# EAGLE design vcf_leiter (EAGLE 9.5.2)
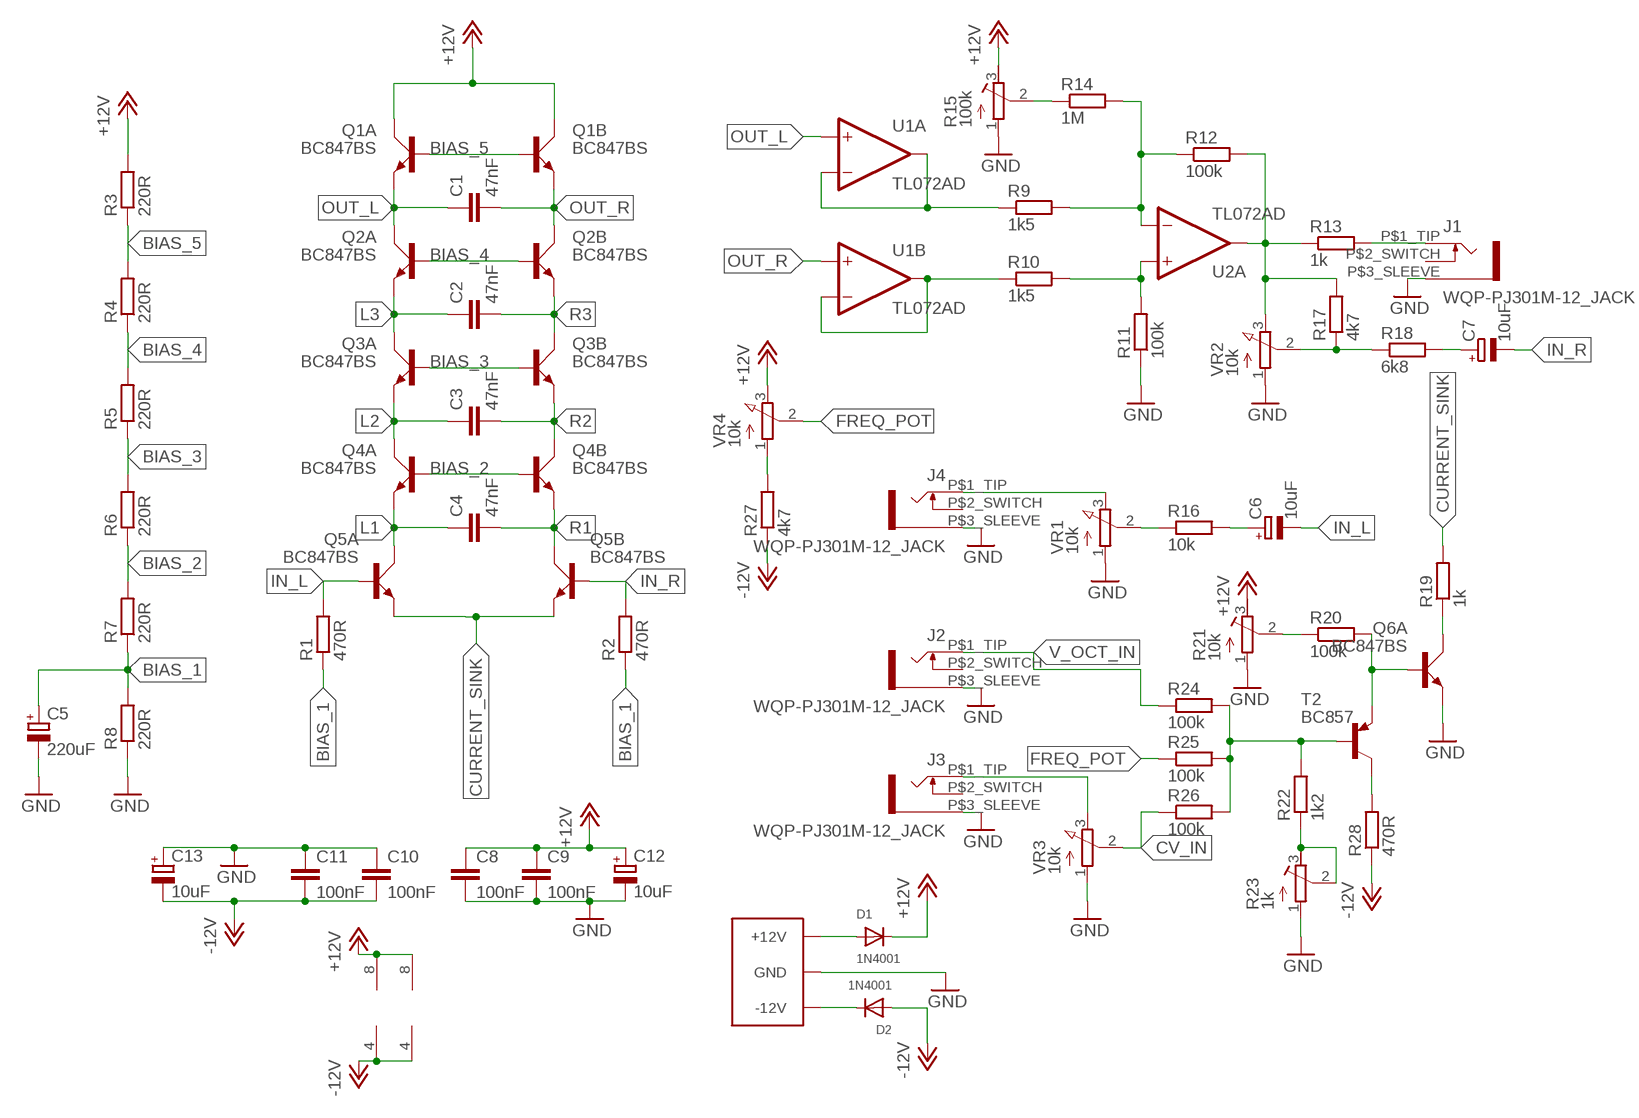
[diagram p0: schematic, sheet 1]

## Parts
C1  47nF  C-EUC0402  [C0402]
C2  47nF  C-EUC0402  [C0402]
C3  47nF  C-EUC0402  [C0402]
C4  47nF  C-EUC0402  [C0402]
C5  220uF  CPOL-EUC  [PANASONIC_C]
C6  10uF  CPOL-EUC  [PANASONIC_C]
C7  10uF  CPOL-EUC  [PANASONIC_C]
C8  100nF  C-EUC0402  [C0402]
C9  100nF  C-EUC0402  [C0402]
C10  100nF  C-EUC0402  [C0402]
C11  100nF  C-EUC0402  [C0402]
C12  10uF  CPOL-EUC  [PANASONIC_C]
C13  10uF  CPOL-EUC  [PANASONIC_C]
C14  EURO_POWER_LOCKFAT-LOCK  [EURO_PWR_HEADER_LOCK]
D1  1N4001  DIODESMA  [SMADIODE]
D2  1N4001  DIODESMA  [SMADIODE]
J1  WQP-PJ301M-12_JACK  [WQP-PJ301M-12_JACK]
J2  WQP-PJ301M-12_JACK  [WQP-PJ301M-12_JACK]
J3  WQP-PJ301M-12_JACK  [WQP-PJ301M-12_JACK]
J4  WQP-PJ301M-12_JACK  [WQP-PJ301M-12_JACK]
Q1  BC847BS  [SOT363_PHILIPS]
Q2  BC847BS  [SOT363_PHILIPS]
Q3  BC847BS  [SOT363_PHILIPS]
Q4  BC847BS  [SOT363_PHILIPS]
Q5  BC847BS  [SOT363_PHILIPS]
Q6  BC847BS  [SOT363_PHILIPS]
R1  470R  R-EU_R0402  [R0402]
R2  470R  R-EU_R0402  [R0402]
R3  220R  R-EU_R0402  [R0402]
R4  220R  R-EU_R0402  [R0402]
R5  220R  R-EU_R0402  [R0402]
R6  220R  R-EU_R0402  [R0402]
R7  220R  R-EU_R0402  [R0402]
R8  220R  R-EU_R0402  [R0402]
R9  1k5  R-EU_R0402  [R0402]
R10  1k5  R-EU_R0402  [R0402]
R11  100k  R-EU_R0402  [R0402]
R12  100k  R-EU_R0402  [R0402]
R13  1k  R-EU_R0402  [R0402]
R14  1M  R-EU_R0402  [R0402]
R15  100k  R-TRIMM64W  [RTRIM64W]
R16  10k  R-EU_R0402  [R0402]
R17  4k7  R-EU_R0402  [R0402]
R18  6k8  R-EU_R0402  [R0402]
R19  1k  R-EU_R0402  [R0402]
R20  100k  R-EU_R0402  [R0402]
R21  10k  R-TRIMM64W  [RTRIM64W]
R22  1k2  R-EU_R0402  [R0402]
R23  1k  R-TRIMM64W  [RTRIM64W]
R24  100k  R-EU_R0402  [R0402]
R25  100k  R-EU_R0402  [R0402]
R26  100k  R-EU_R0402  [R0402]
R27  4k7  R-EU_R0402  [R0402]
R28  470R  R-EU_R0402  [R0402]
T2  BC857  BC857C-PNP-SOT23-BEC  [SOT23-BEC]
U1  TL072AD  [SOIC8]
U2  TL072AD  [SOIC8]
VR1  10k  9MM_SNAP-IN_POT_  [9MM_SNAP-IN_POT]
VR2  10k  9MM_SNAP-IN_POT_  [9MM_SNAP-IN_POT]
VR3  10k  9MM_SNAP-IN_POT_  [9MM_SNAP-IN_POT]
VR4  10k  9MM_SNAP-IN_POT_  [9MM_SNAP-IN_POT]

## Nets
+12V [power]: C8.1 C9.1 C12.+ D1.C Q1.3(B:C) Q1.6(A:C) R3.2 R15.3(E) R21.3(E) U1.8(P:V+) U2.8(P:V+) VR4.3(E)
-12V [power]: C10.2 C11.2 C13.- D2.A R27.1 R28.1 U1.4(P:V-) U2.4(P:V-)
BIAS_1: C5.+ R1.1 R2.1 R7.1 R8.2
BIAS_2: Q4.2(A:B) Q4.5(B:B) R6.1 R7.2
BIAS_3: Q3.2(A:B) Q3.5(B:B) R5.1 R6.2
BIAS_4: Q2.2(A:B) Q2.5(B:B) R4.1 R5.2
BIAS_5: Q1.2(A:B) Q1.5(B:B) R3.1 R4.2
CURRENT_SINK: Q5.1(A:E) Q5.4(B:E) R19.2
CV_IN: R26.1 VR3.2(S)
FREQ_POT: R25.1 VR4.2(S)
GND [power]: C5.- C8.2 C9.2 C10.1 C11.1 C12.- C13.+ C14.GND1(GND) C14.GND2(GND) C14.GND3(GND) C14.GND4(GND) C14.GND5(GND) C14.GND6(GND) J1.P$3_SLEEVE J2.P$3_SLEEVE J3.P$3_SLEEVE J4.P$3_SLEEVE Q6.1(A:E) R8.1 R11.1 R15.1(A) R21.1(A) R23.1(A) VR1.1(A) VR2.1(A) VR3.1(A)
IN_L: C6.- Q5.2(A:B) R1.2
IN_R: C7.- Q5.5(B:B) R2.2
L1: C4.1 Q4.1(A:E) Q5.6(A:C)
L2: C3.1 Q3.1(A:E) Q4.6(A:C)
L3: C2.1 Q2.1(A:E) Q3.6(A:C)
N$1: R9.1 U1.1(A:OUT) U1.2(A:-IN)
N$2: R10.1 U1.6(B:-IN) U1.7(B:OUT)
N$3: R10.2 R11.2 U2.3(A:+IN)
N$4: R9.2 R12.1 R14.2 U2.2(A:-IN)
N$5: J4.P$1_TIP VR1.3(E)
N$6: R12.2 R13.1 R17.2 U2.1(A:OUT) VR2.3(E)
N$7: R14.1 R15.2(S)
N$8: R16.1 VR1.2(S)
N$9: C6.+ R16.2
N$10: J1.P$1_TIP R13.2
N$11: R17.1 R18.1 VR2.2(S)
N$12: C7.+ R18.2
N$13: Q6.2(A:B) R20.2 T2.E
N$14: J3.P$1_TIP VR3.3(E)
N$15: Q6.6(A:C) R19.1
N$16: R20.1 R21.2(S)
N$17: R22.2 R24.2 R25.2 R26.2 T2.B
N$18: R22.1 R23.2(S) R23.3(E)
N$19: R27.2 VR4.1(A)
N$20: R28.2 T2.C
N$21 [power]: C14.POS1(+12V) C14.POS2(+12V) D1.A
N$22 [power]: C14.NEG1(-12V) C14.NEG2(-12V) D2.C
OUT_L: C1.1 Q1.1(A:E) Q2.6(A:C) U1.3(A:+IN)
OUT_R: C1.2 Q1.4(B:E) Q2.3(B:C) U1.5(B:+IN)
R1: C4.2 Q4.4(B:E) Q5.3(B:C)
R2: C3.2 Q3.4(B:E) Q4.3(B:C)
R3: C2.2 Q2.4(B:E) Q3.3(B:C)
V_OCT_IN: J2.P$1_TIP R24.1
Unconnected: J1.P$2_SWITCH J2.P$2_SWITCH J3.P$2_SWITCH J4.P$2_SWITCH Q6.3(B:C) Q6.4(B:E) Q6.5(B:B) U2.5(B:+IN) U2.6(B:-IN) U2.7(B:OUT)

## Library data of the parts
C1-C4 C8-C11 = jhbruhn-cr:C-EU: CAPACITOR, European symbol; SPICEPREFIX: C
C5-C7 C12 C13 = rcl:CPOL-EU: POLARIZED CAPACITOR, European symbol; SPICEPREFIX: C
C14 = jhbruhn-physical:EURO_POWER_LOCK
D1 D2 = adafruit:DIODE: Diode SMADIODE - SMA Surface Mount Package 20V 1A Schottky Diode Digikey: 641-1014-6-ND DO-1N4148 - Through Hole Small Current Diode SOD-123 20V 1 A (.5mV Vf) Schottky Diode - Digikey: MBRX120TPMSCT-ND SOD-323 10V 570mA (.38mV Vf, 3ns) Schottky Diode - Digikey: ZLLS410CT-ND SOD-523 30V 30mA Schottky Diode (RB751S-40TE61) - Digikey: RB751S-40TE61CT-ND SOT23-R/W - SOT23 Package (R = Solder Paste/Reflow Ovens, W = Hand-Soldering) BAT54Film 40V 300mA - Digikey: 497-7162-1-ND
J1-J4 = jhbruhn-physical:WQP-PJ301M-12_JACK
Q1-Q6 = transistor-small-signal:BC847BS: NPN general purpose double transistor Source: http://www.farnell.com/datasheets/2466.pdf
R1-R14 R16-R20 R22 R24-R28 = jhbruhn-cr:R-EU_: RESISTOR, European symbol; SPICEPREFIX: R
R15 R21 R23 = rcl:R-TRIMM: Trimm resistor; SPICEMODEL: X; SPICEPREFIXL: POT
T2 = transistor:*-PNP-: PNP Transistror
U1 U2 = jhbruhn-opamp:TL072: Generic Dual Op Amp
VR1-VR4 = jhbruhn-physical:9MM_SNAP-IN_POT: 9mm vertical snap-in pot, Alpha / Panasonic style

## Net classes
0 default: width 0.254 mm, drill 0.254 mm
1 power: width 0.406 mm, drill 0.406 mm

## Board
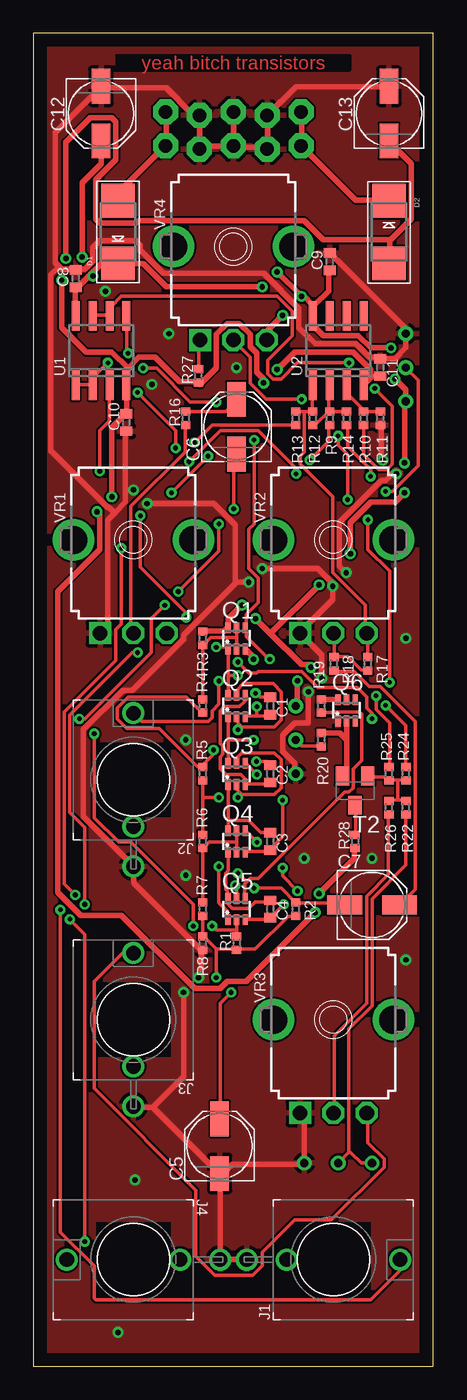
[diagram p1: board, top side]
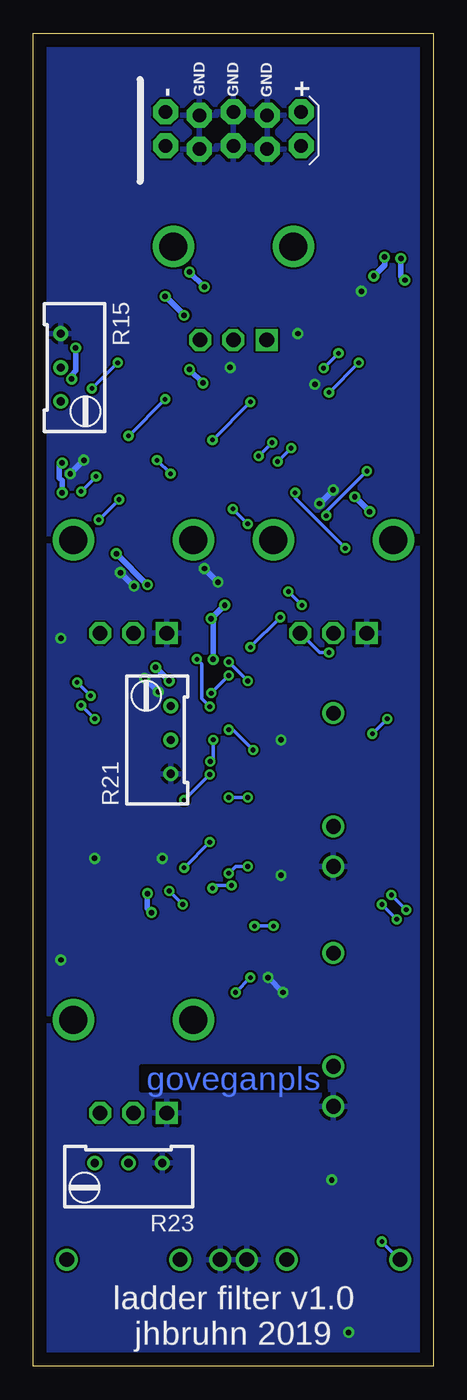
[diagram p2: board, bottom side, seen from below]

Size 30 x 100 mm. Coordinates in mm from the lower left corner, seen from the top.
Outline: 0,0 30,0 30,100 0,100 0,0
Copper layers (1*16): Top 0.035mm / dielectric 1.5mm / Bottom 0.035mm
Design rules "default": minimum track width 6mil, minimum drill 0.35mm, track to track 6mil, track to pad 6mil, pad to pad 6mil, via to via 6mil, smd to smd 6mil, copper to edge 40mil, drill to drill 6mil, minimum pad ring 10mil, minimum via ring 8mil, stop-mask expansion 4mil, vias tented up to drill 0mil, thermal gap 10mil

### Footprints (pad centres in the part's own frame; a part is rotated, then mirrored left to right if it is on the bottom)
C0402 = smd 0.7 x 0.9: 1 -0.65,0; 2 0.65,0
PANASONIC_C = smd 2.6 x 1.4: + 2.05,0; - -2.05,0
EURO_PWR_HEADER_LOCK = drill 1.016 pad 1.88 octagon: GND1 -2.54,1.143; GND2 -2.54,-1.397; GND3 0,1.397; GND4 0,-1.143; GND5 2.54,1.143; GND6 2.54,-1.397; NEG1 -5.08,1.397; NEG2 -5.08,-1.143; POS1 5.08,1.397; POS2 5.08,-1.143
SMADIODE = smd 2.54 x 2.54: A 2.349,0; C -2.349,0
WQP-PJ301M-12_JACK = drill 1.1: P$1_TIP 0,5; P$2_SWITCH 0,-3.5; P$3_SLEEVE 0,-6.5
SOT363_PHILIPS = smd 0.4 x 0.8: 1 -0.65,-0.8; 2 0,-0.8; 3 0.65,-0.8; 4 0.65,0.8; 5 0,0.8; 6 -0.65,0.8
R0402 = smd 0.6 x 0.7: 1 -0.5,0; 2 0.5,0
RTRIM64W = drill 0.61: 1 1.27,-2.54; 2 1.27,0; 3 1.27,2.54
SOT23-BEC = smd 1 x 1.4: B -0.95,-1.1; C 0,1.1; E 0.95,-1.1
SOIC8 = smd 0.6 x 2.2: 1 -1.905,-2.6; 2 -0.635,-2.6; 3 0.635,-2.6; 4 1.905,-2.6; 5 1.905,2.6; 6 0.635,2.6; 7 -0.635,2.6; 8 -1.905,2.6
9MM_SNAP-IN_POT = drill 1.1 square: 1 -2.5,-7 | drill 1.1 octagon: 2 0,-7; 3 2.5,-7 | drill 2.1 pad 2.794: CHASSIS1 -4.5,0; CHASSIS2 4.5,0

### Placement (x,y rotation side)
C1  17.78,49.53 270 top
C2  17.78,44.45 270 top
C3  17.78,39.37 270 top
C4  17.78,34.29 270 top
C5  13.97,16.51 90 top
C6  15.24,70.48 90 top
C7  25.4,34.61 0 top
C8  3.17,81.6 90 top
C9  22.23,82.87 90 top
C10  6.99,70.8 90 top
C11  26.04,74.93 270 top
C12  5.08,93.98 270 top
C13  26.67,93.98 90 top
C14  15,92.71 0 bottom
D1  6.35,85.09 90 top
D2  26.67,85.09 270 top
J1  22.5,8 270 top
J2  7.5,44 0 top
J3  7.5,26 0 top
J4  7.5,8 90 top
Q1  15.24,54.61 0 top
Q2  15.24,49.53 0 top
Q3  15.24,44.45 0 top
Q4  15.24,39.37 0 top
Q5  15.24,34.29 0 top
Q6  23.5,49.21 0 top
R1  15.24,31.75 90 top
R2  19.68,34.29 90 top
R3  12.7,54.61 90 top
R4  12.7,49.53 90 top
R5  12.7,44.45 90 top
R6  12.7,39.37 90 top
R7  12.7,34.29 90 top
R8  12.7,31.75 90 top
R9  22.23,71.12 90 top
R10  24.77,71.12 90 top
R11  26.04,71.12 90 top
R12  20.95,71.12 90 top
R13  19.68,71.12 270 top
R14  23.5,71.12 90 top
R15  26.67,74.93 180 bottom
R16  11.43,71.12 90 top
R17  25.08,52.7 90 top
R18  22.54,52.7 270 top
R19  21.59,49.53 270 top
R20  21.59,46.99 90 top
R21  20.95,46.99 0 bottom
R22  27.94,41.91 90 top
R23  22.86,13.97 90 bottom
R24  27.94,44.45 270 top
R25  26.67,44.45 270 top
R26  26.67,41.91 90 top
R27  12.38,74.3 90 top
R28  24.13,39.37 90 top
T2  24.13,43.18 180 top
U1  5.08,76.2 0 top
U2  22.86,76.2 0 top
VR1  7.5,62 0 top
VR2  22.5,62 0 top
VR3  22.5,26 0 top
VR4  15,84 0 top

### Tracks (layer width: path | path; a pad name or v marks a point on that pad's centre or on a via)
+12V  (via drill 0.41)
  Top 0.406: U1.8 3.15,78.84 3.15,80.87 C8.1 3.35,80.97 4.27,81.89 | 4.27,81.89 5.08,82.7 6.3,82.7 D1.C 6.5,82.7 8.23,82.7 9.96,80.97 v17.17,80.97 | C12.+ 5.08,90.22 3.66,88.8 v3.66,83.21 | v4.47,81.79 4.37,81.79 4.27,81.89 | R3.2 12.7,55.17 14.33,55.17 14.53,55.37 Q1.6 14.63,55.58 14.63,56.08 v15.65,57.1 | 17.78,54.97 20.12,52.63 20.62,52.63 v20.83,52.43 | 17.78,54.97 v16.66,56.08 | v19.81,51.41 19.81,49.68 19.71,49.58 R21.3 | C9.1 22.15,82.19 22.15,80.67 21.03,79.55 21.03,78.84 U2.8 | v27.13,74.07 27.94,73.25 R15.3 27.84,72.24 v27.84,67.77 | v26.82,76.4 25.3,76.4 24.38,77.32 21.74,77.32 21.03,78.03 21.03,78.64 U2.8 | v18.69,78.84 17.58,77.72 17.58,77.01 VR4.3 | U2.8 20.93,79.65 20.32,80.26 v20.12,80.26 v18.29,82.09 | v21.44,58.62 17.78,54.97 | v23.77,60.96 23.77,63.3 25.3,64.82 27.13,64.82 v27.84,65.53 | Q1.3 16.51,53.19 v16.51,53.02
  Bottom 0.406: v3.66,83.21 3.66,82.6 v4.47,81.79 | v15.65,57.1 v16.66,56.08 16.51,55.93 v16.51,53.02 | v19.81,51.41 v20.83,52.43 | v27.13,74.07 27.13,74.37 26.82,74.68 v26.82,76.4 | v20.12,80.26 v18.69,78.84 | v23.77,60.96 v21.44,58.62 | v27.84,65.53 27.84,66.45 28.04,66.65 28.04,67.56 v27.84,67.77 | v18.29,82.09 v17.17,80.97
-12V  (via drill 0.41)
  Top 0.406: 26.72,84.43 26.72,82.8 D2.A | 26.72,84.43 28.35,86.06 28.35,90.22 26.72,91.85 C13.- | 25.4,74.27 26.01,74.27 C11.2 | 25.4,74.27 24.79,73.66 U2.4 | 7.11,74.88 7.01,74.78 7.01,73.66 U1.4 7.01,73.46 7.01,71.63 C10.2 6.91,71.42 5.89,70.41 v5.89,65.23 | 7.11,74.88 7.92,75.69 9.14,75.69 10.97,73.86 12.29,73.86 R27.1 12.5,73.66 13.72,74.88 13.72,77.42 14.53,78.23 15.44,78.23 16.26,77.42 16.26,76.5 16.76,76 16.76,74.57 17.27,74.07 v17.27,73.76 | v18.29,74.78 19.61,76.1 23.98,76.1 25.3,74.78 25.3,74.37 25.4,74.27 | v2.44,83.11 2.44,91.85 4.27,93.67 5.89,93.67 6.2,93.37 6.2,90.53 4.67,89 4.67,86.06 4.98,85.75 7.72,85.75 7.92,85.95 20.32,85.95 21.74,84.53 26.62,84.53 26.72,84.43 | v2.13,81.48 2.13,77.93 3.96,76.1 5.89,76.1 7.11,74.88 | v21.44,35.46 24.08,38.1 24.08,38.81 R28.1 | v21.13,34.04 15.95,28.85 14.53,28.85 14.02,28.35 12.09,28.35 6.6,33.83 3.56,33.83 1.83,35.56 1.83,58.12 4.98,61.27 4.98,63.91 v4.78,64.11
  Bottom 0.406: v17.27,73.76 v18.29,74.78 | v2.44,83.11 2.44,81.79 v2.13,81.48 | v21.44,35.46 21.44,34.34 v21.13,34.04 | v5.89,65.23 v4.78,64.11
BIAS_1  (via drill 0.35)
  Top 0.254: R7.1 R8.2 12.8,32.21 13.72,31.29 | 13.72,31.29 15.24,31.29 R1.1 15.34,31.29 16.66,31.29 19.1,33.73 19.61,33.73 R2.1 | v14.83,28.04 14.02,27.23 14.02,18.59 C5.+ | 13.72,31.29 v13.72,29.16
  Bottom 0.254: v13.72,29.16 v14.83,28.04
BIAS_2
  Top 0.254: Q4.5 15.24,39.32 | 15.24,39.32 Q4.2 | R7.2 R6.1 12.8,38.91 13.21,39.32 15.24,39.32
BIAS_3  (via drill 0.35)
  Top 0.254: R5.1 12.7,42.67 | 12.7,42.67 R6.2 | Q3.2 15.24,43.28 15.6,42.93 | 15.6,42.93 15.65,42.88 18.09,42.88 18.59,43.38 18.59,45.52 18.09,46.02 15.65,46.02 15.24,45.62 Q3.5 | v13.92,42.67 12.7,42.67 | 15.6,42.93 v15.34,42.67
  Bottom 0.254: v15.34,42.67 v13.92,42.67
BIAS_4  (via drill 0.35)
  Top 0.254: Q2.2 15.24,48.36 15.6,48.01 | 15.6,48.01 15.65,47.95 18.09,47.95 18.59,48.46 18.59,50.6 17.98,51.21 15.75,51.21 15.24,50.7 Q2.5 | R4.1 12.7,48.97 11.48,50.19 7.11,50.19 6.3,49.38 6.3,48.56 7.01,47.85 9.45,47.85 12.29,45.01 12.7,45.01 R5.2 12.7,45.11 13.51,45.92 v13.51,46.23 | v15.34,47.75 15.6,48.01
  Bottom 0.254: v15.34,47.75 15.04,47.75 v13.51,46.23
BIAS_5
  Top 0.254: Q1.5 15.24,54.66 | 15.24,54.66 Q1.2 | R4.2 R3.1 12.8,54.15 13.31,54.66 15.24,54.66
CURRENT_SINK  (via drill 0.35)
  Top 0.254: 16,36.32 15.85,36.17 15.85,35.15 Q5.4 | 16,36.32 16.26,36.58 16.87,36.58 23.37,43.08 23.67,43.08 23.98,43.38 23.98,44.81 24.62,45.45 24.62,48.93 24.46,49.09 22.53,49.09 22.47,49.03 R19.2 21.64,49.07 | v13.92,37.49 13.92,34.75 14.53,34.14 14.53,33.53 Q5.1 | 16,36.32 v15.34,36.98
  Bottom 0.254: v13.92,37.49 14.83,37.49 v15.34,36.98
CV_IN
  Top 0.254: R26.1 26.62,41.35 26.62,36.88 24.99,35.26 24.99,27.23 22.55,24.79 22.55,19.1 VR3.2
FREQ_POT  (via drill 0.35)
  Top 0.254: v25.7,50.29 25.7,49.28 26.72,48.26 26.72,45.01 R25.1 | v26.72,51.31 26.72,59.64 25.09,61.27 v25.09,63.5 | v23.57,65.02 23.57,68.38 22.86,69.09 v22.86,69.8 | v20.12,72.54 17.48,72.54 16.26,73.76 16.26,75.69 15.04,76.91 VR4.2
  Bottom 0.254: v26.72,51.31 v25.7,50.29 | v23.57,65.02 v25.09,63.5 | v20.12,72.54 v22.86,69.8
GND  (via drill 0.41)
  Top 0.406: C14.GND4 14.94,91.54 12.6,91.54 C14.GND6 12.5,91.34 12.5,93.78 C14.GND5 12.29,93.98 11.89,93.98 9.96,95.91 5.18,95.91 C12.- 5.08,96.01 1.63,92.56 1.63,82.8 1.93,82.5 | C14.GND3 15.04,94.08 15.04,91.75 C14.GND4 | C13.+ 26.62,96.01 19.71,96.01 17.58,93.88 C14.GND1 17.58,93.67 17.58,91.34 C14.GND2 17.37,91.44 15.14,91.44 C14.GND4 | 6.91,65.73 6.91,64.82 6.1,64.01 | 6.91,65.73 6.91,70.1 C10.1 | 6.1,64.01 5.59,63.5 5.59,55.58 5.08,55.07 VR1.1 | C9.2 22.25,83.52 27.84,77.93 27.84,77.62 R15.1 27.94,76.4 27.13,75.59 26.11,75.59 C11.1 25.91,75.69 25.2,75.69 24.18,76.71 21.13,76.71 19.91,77.93 19.91,79.35 17.27,81.99 9.75,81.99 8.03,83.72 8.03,84.12 7.72,84.43 4.98,84.43 4.47,83.92 4.47,82.91 3.86,82.3 3.35,82.3 C8.2 3.15,82.3 2.13,82.3 1.93,82.5 | 6.1,64.01 5.69,64.41 5.59,64.41 1.32,68.68 1.32,81.89 1.93,82.5 | R21.1 19.61,44.5 19.61,45.21 18.69,46.13 18.69,47.35 19.61,48.26 20.62,48.26 v20.62,50.6 | v26.21,67.97 26.11,68.07 26.11,70.61 R11.1 | v27.23,66.95 26.92,66.95 26.42,66.45 26.11,66.45 22.96,63.3 22.96,60.05 v23.47,59.54 | v21.64,51.61 21.64,53.34 20.12,54.86 VR2.1 20.02,55.07 22.45,57.51 v22.45,58.52 22.35,58.62 22.35,58.83 21.34,59.84 v17.17,59.84 | VR3.1 20.02,19 20.32,18.69 R23.1 20.22,15.14 14.94,15.14 14.22,14.43 C5.- | C5.- 14.02,14.43 14.02,8.03 J4.P$3_SLEEVE 14.22,8.03 15.95,8.03 J1.P$3_SLEEVE | 8.94,19.41 7.52,19.41 J3.P$3_SLEEVE | 8.94,19.41 13.82,14.53 C5.- | v12.39,29.16 12.6,29.36 12.6,31.09 R8.1 12.7,31.29 12.5,31.29 7.52,36.27 7.52,37.49 J2.P$3_SLEEVE 7.42,37.59 3.76,41.25 3.76,47.75 6.71,50.7 7.42,50.7 11.28,54.56 11.28,54.86 15.24,58.83
  Top 0.406: v11.28,28.04 11.28,21.74 8.94,19.41 | 15.24,58.83 v16.15,58.83 | v7.52,65.73 6.91,65.73 | v8.53,64.72 13.51,64.72 15.14,63.09 15.14,58.93 15.24,58.83
  Bottom 0.406: v27.23,66.95 v26.21,67.97 | v22.45,58.52 v23.47,59.54 | v21.64,51.61 v20.62,50.6 | v11.28,28.04 v12.39,29.16 | v16.15,58.83 v17.17,59.84 | v8.53,64.72 v7.52,65.73
  other vias: 10.16,77.47 11.43,36.83 20.32,38.1 7.62,13.97 6.35,2.54 27.94,30.48 27.94,54.61 15.24,74.93 8.89,73.66 5.4,80.64 11.43,46.99 25.4,38.1
  pour Bottom: 0,100.33 0,0 30.48,0 30.48,100.33
  pour Top: 0,100.33 0,0 30.48,0 30.48,100.33
IN_L  (via drill 0.35)
  Top 0.254: Q5.2 15.24,32.72 | 15.24,32.72 R1.2 | 15.24,32.72 13.72,32.72 v13.41,33.02 | v11.99,33.02 11.99,34.65 7.32,39.32 6.4,39.32 4.57,41.15 v4.57,47.45 | v3.45,48.56 3.86,48.56 8.84,53.54 8.84,56.08 v9.86,57.1 | v10.87,58.12 13.92,61.16 v13.92,63.2 | v15.04,64.31 15.04,68.17 15.24,68.38 C6.-
  Bottom 0.254: v11.99,33.02 v13.41,33.02 | v3.45,48.56 v4.57,47.45 | v10.87,58.12 v9.86,57.1 | v15.04,64.31 v13.92,63.2
IN_R  (via drill 0.35)
  Top 0.254: C7.- 23.27,34.65 23.16,34.75 19.71,34.75 R2.2 19.61,34.85 18.59,35.87 v16.56,35.87 | Q5.5 15.24,35.97 v15.14,36.07
  Bottom 0.254: v15.14,36.07 16.36,36.07 v16.56,35.87
L1
  Top 0.254: Q4.1 14.63,38.51 14.63,37.19 14.43,36.98 14.43,35.76 14.53,35.66 14.53,35.15 Q5.6 14.63,35.05 14.63,34.65 14.94,34.34 16.15,34.34 16.66,34.85 17.78,34.85 C4.1
L2
  Top 0.254: 14.63,40.95 14.63,43.59 Q3.1 | 14.63,40.95 14.63,40.23 Q4.6 | 14.63,40.95 16.15,40.95 17.07,40.03 C3.1
L3  (via drill 0.35)
  Top 0.254: 14.63,46.99 14.63,48.67 Q2.1 | 14.63,46.99 14.63,45.31 Q3.6 | C2.1 17.51,45.37 v16.73,45.37 | v16.51,46.99 14.63,46.99
  Bottom 0.254: v16.73,45.37 16.51,45.58 v16.51,46.99
N$1  (via drill 0.35)
  Top 0.254: v20.73,67.97 22.15,69.39 22.15,70.61 R9.1 | v19.71,66.95 19.71,67.36 16.87,70.21 14.02,70.21 v11.68,67.87 | v10.67,68.89 10.67,70.21 v7.82,73.05 | v5.59,75.29 4.47,74.17 4.47,73.66 U1.2 4.37,73.66 3.25,73.66 U1.1
  Bottom 0.254: v19.71,66.95 v20.73,67.97 | v10.67,68.89 v11.68,67.87 | v5.59,75.29 v7.82,73.05
N$2  (via drill 0.35)
  Top 0.254: v25.6,73.36 26.92,72.03 26.92,67.67 26.52,67.26 25.91,67.26 24.79,68.38 24.79,70.61 R10.1 | v23.67,75.29 19.81,75.29 18.59,74.07 17.98,74.07 17.58,74.47 17.58,75.49 19.41,77.32 19.41,79.15 18.29,80.26 6.6,80.26 5.79,79.45 5.79,78.84 U1.6 5.69,78.84 4.47,78.84 U1.7
  Bottom 0.254: v23.67,75.29 v25.6,73.36
N$3
  Top 0.254: R11.2 26.01,71.63 24.79,71.63 R10.2 24.79,71.73 23.57,72.95 23.57,73.56 U2.3
N$4
  Top 0.254: R12.1 21.03,70.71 21.23,70.71 22.15,71.63 R9.2 | R14.2 23.47,71.63 22.35,71.63 R9.2 | R9.2 22.15,71.73 22.15,73.56 U2.2
N$5  (via drill 0.35)
  Top 0.254: v3.86,9.35 3.86,32.41 v2.74,33.53 | v3.86,34.65 3.86,40.44 2.74,41.55 2.74,48.87 7.42,53.54 v7.82,53.54
  Bottom 0.254: v3.86,9.35 2.54,8.03 J4.P$1_TIP | v3.86,34.65 v2.74,33.53 | v7.82,53.54 8.53,53.54 9.96,54.97 VR1.3
N$6
  Top 0.254: 20.32,71.63 20.93,71.63 R12.2 20.93,71.73 20.93,73.56 U2.1 | 20.32,71.63 19.71,71.63 R13.1 | R17.2 25.09,53.24 25.09,54.97 VR2.3 24.89,55.07 24.89,57.1 22.45,59.54 22.45,65.23 20.02,67.67 20.02,68.28 20.32,68.58 20.32,71.63
N$7  (via drill 0.35)
  Top 0.254: v25.3,66.75 25.3,67.26 23.57,68.99 23.57,70.61 R14.1 | v26.42,65.63 26.92,65.63 28.85,67.56 28.85,73.97 27.94,74.88 R15.2
  Bottom 0.254: v26.42,65.63 v25.3,66.75
N$8
  Top 0.254: R16.1 11.38,70.61 11.38,68.58 7.32,64.52 7.32,55.17 7.42,55.07 VR1.2
N$9
  Top 0.254: R16.2 11.48,71.63 14.43,71.63 15.24,72.44 C6.+
N$10  (via drill 0.35)
  Top 0.254: v12.09,69.29 13.41,70.61 19.61,70.61 R13.2 | v10.36,65.53 v13.11,68.28 | v6.6,61.37 6.6,55.68 6.2,55.27 6.2,52.93 2.34,49.07 2.34,36.17 v3.15,35.36 | v2.03,34.24 2.03,10.06 4.57,7.52 4.57,5.08 4.67,4.98 25.3,4.98 27.43,7.11 27.43,7.92 J1.P$1_TIP
  Bottom 0.254: v13.11,68.28 v12.09,69.29 | v10.36,65.53 10.36,65.13 v6.6,61.37 | v2.03,34.24 v3.15,35.36
N$11
  Top 0.254: VR2.2 22.55,54.97 22.55,53.24 R18.1 22.66,53.24 23.57,53.24 24.59,52.22 24.99,52.22 R17.1
N$12
  Top 0.254: R18.2 22.55,52.12 24.08,52.12 25.2,51 26.01,51 28.65,48.36 28.65,35.76 27.53,34.65 C7.+
N$13
  Top 0.254: 21.64,47.45 R20.2 | 23.16,44.3 T2.E
  Top 0.406: Q6.2 23.5,46.99 | 23.5,46.99 23.5,44.63 23.16,44.3 | R20.2 23,47.49 23.5,46.99
N$14
  Top 0.254: VR3.3 25.09,19 25.09,16.76 26.31,15.54 26.31,14.94 22.35,10.97 19.61,10.97 17.17,8.53 17.17,7.52 16.46,6.81 13.61,6.81 12.19,8.23 12.19,13.21 4.57,20.83 4.57,28.85 6.71,30.99 7.42,30.99 J3.P$1_TIP
N$15
  Top 0.254: 21.64,49.99 R19.1
  Top 0.406: R19.1 21.61,50.01 Q6.6
N$16
  Top 0.254: R20.1 21.54,46.53 20.12,46.53 19.71,46.94 R21.2
N$17
  Top 0.254: 27.33,42.47 27.94,42.47 R22.2 | 27.33,42.47 26.72,42.47 R26.2 | 27.33,43.99 27.94,43.99 R24.2 | 27.33,43.99 26.72,43.99 R25.2 26.62,43.99 26.42,44.2 25.09,44.2 T2.B | 27.33,43.99 27.33,42.47
N$18
  Top 0.254: R22.1 27.94,37.59 25.4,35.05 25.4,27.03 23.67,25.3 23.67,16.05 | R23.2 23.67,16.05 | R23.3 24.59,15.24 23.77,16.05 23.67,16.05
N$19
  Top 0.254: R27.2 12.39,74.88 12.39,76.81 12.5,76.91 VR4.1
N$20
  Top 0.254: R28.2 24.18,39.93 24.18,42.06 T2.C
N$21
  Top 0.406: D1.A 6.4,87.48 6.4,88.09 9.86,91.54 C14.POS2 9.96,91.75 9.96,94.08 C14.POS1
N$22
  Top 0.406: D2.C 26.62,87.48 24.18,87.48 20.12,91.54 C14.NEG2 20.12,91.75 20.12,94.08 C14.NEG1
OUT_L  (via drill 0.35)
  Top 0.254: 14.63,51.82 14.63,53.75 Q1.1 14.53,53.85 14.43,53.95 v13.72,53.95 | 14.63,51.82 14.63,50.39 Q2.6 | v16.66,50.49 16.97,50.19 C1.1 | 14.63,51.82 v15.34,51.82 | v4.98,67.16 4.98,70.21 5.69,70.92 5.69,73.56 U1.3 | v8.03,63.8 8.03,59.94 11.48,56.49 v11.48,56.19
  Bottom 0.254: v15.34,51.82 v16.66,50.49 | v4.98,67.16 8.03,64.11 v8.03,63.8 | v13.72,53.95 v11.48,56.19
OUT_R  (via drill 0.35)
  Top 0.254: 16.76,48.77 17.68,48.77 C1.2 | 16.76,48.77 15.95,48.77 Q2.3 | v17.73,53.05 17.67,53.05 15.95,54.76 15.95,55.37 Q1.4 15.95,55.47 15.95,56.39 16.87,57.3 16.87,59.13 16.15,59.84 16.15,62.79 16.56,63.2 v16.56,69.49 | 16.76,48.77 v16.76,49.48 | v7.11,76 7.01,76.1 7.01,78.74 U1.5 | v8.23,74.88 9.25,74.88 11.79,72.34 v13.72,72.34
  Bottom 0.254: v17.73,53.05 17.37,52.69 17.37,50.09 v16.76,49.48 | v8.23,74.88 v7.11,76 | v16.56,69.49 v13.72,72.34
R1  (via drill 0.35)
  Top 0.254: C4.2 17.68,33.53 15.95,33.53 Q5.3 | v16.76,39.32 15.95,40.13 Q4.4 | v18.69,37.39 18.69,36.78 v19.81,35.66 | C4.2 v18.8,34.65 | C4.2
  Bottom 0.254: v18.69,37.39 v16.76,39.32 | v18.8,34.65 v19.81,35.66
R2  (via drill 0.35)
  Top 0.254: Q4.3 15.95,38.61 17.68,38.61 C3.2 17.78,38.81 18.69,39.73 v18.69,42.47 | v16.76,44.4 15.95,45.21 Q3.4
  Bottom 0.254: v18.69,42.47 v16.76,44.4
R3
  Top 0.254: 16.15,43.69 17.68,43.69 C2.2 | 16.15,43.69 15.95,43.69 Q3.3 | Q2.4 15.85,50.29 15.85,49.89 15.44,49.48 14.33,49.48 14.02,49.17 14.02,46.74 14.22,46.53 14.22,45.92 14.02,45.72 14.02,44.81 14.43,44.4 15.54,44.4 16.15,43.79 16.15,43.69
V_OCT_IN  (via drill 0.35)
  Top 0.254: R24.1 27.94,48.06 v26.42,49.58 | v25.4,48.56 25.4,48.97 24.99,49.38 24.99,50.19 24.28,50.9 21.34,50.9 20.12,52.12 16.87,52.12 16.76,52.02 16.15,52.02 v15.34,52.83 | v13.92,51.41 13.92,49.68 13.41,49.17 13.41,48.67 13.11,48.36 8.13,48.36 7.52,48.97 J2.P$1_TIP
  Bottom 0.254: v25.4,48.56 v26.42,49.58 | v13.92,51.41 v15.34,52.83

### Text on the board
Top: yeah bitch transistors
Bottom: goveganpls
bNames: ladder filter v1.0 / jhbruhn 2019